# EAGLE design MODUL_CAN_V100 (EAGLE 6.4)
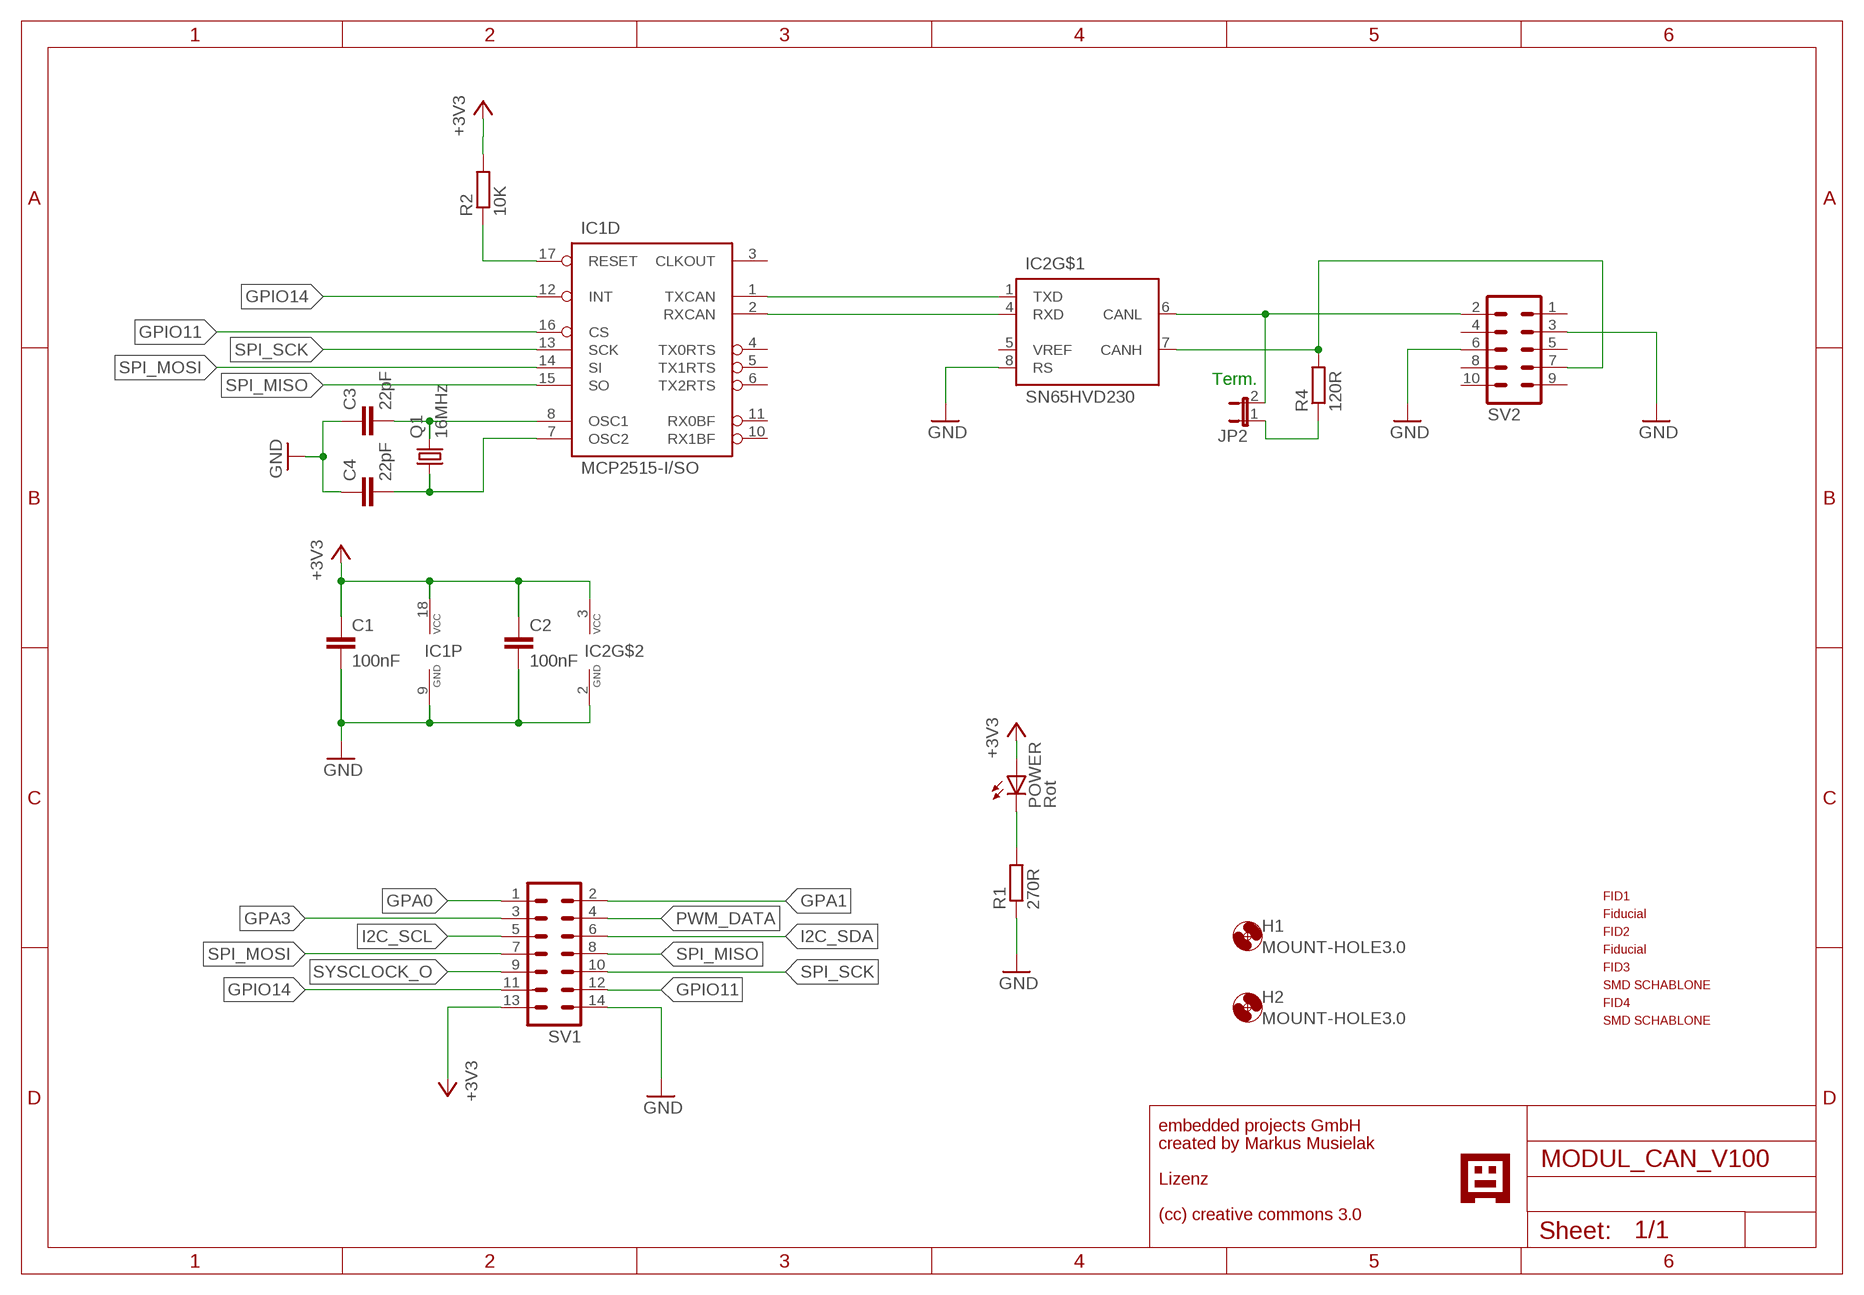
[diagram p0: schematic, sheet 1]

## Parts
C1  100nF  C-EUC0805  [C0805]
C2  100nF  C-EUC0805  [C0805]
C3  22pF  C-EUC0805  [C0805]
C4  22pF  C-EUC0805  [C0805]
FID1  PASSERMARKEN_FIDUCIAL  [PASSERMARKEN_FIDUCIAL]
FID2  PASSERMARKEN_FIDUCIAL  [PASSERMARKEN_FIDUCIAL]
FID3  PASSERMARKEN_FIDUCIAL  [PASSERMARKEN_FIDUCIAL]
FID4  PASSERMARKEN_FIDUCIAL  [PASSERMARKEN_FIDUCIAL]
H1  MOUNT-HOLE3.0  [3,0]
H2  MOUNT-HOLE3.0  [3,0]
IC1  MCP2515-I/SO  MCP2515SO  [SO-18W]
IC2  SN65HVD230  MCP2551SO8  [SO08]
JP2  JP1E  [JP1]
POWER  Rot  LEDCHIP-LED0805  [CHIP-LED0805]
Q1  16MHz  CRYSTALHC49UP  [HC49UP]
R1  270R  R-EU_R0805  [R0805]
R2  10K  R-EU_R0805  [R0805]
R4  120R  R-EU_R0805  [R0805]
SV1  ML14  [ML14]
SV2  ML10  [ML10]
U$2  GNUBLINLOGOSIEB  [GNUSIEBDRUCK]

## Nets
+3V3: C1.1 C2.1 IC1.18(P:VCC) IC2.3(VCC) POWER.A R2.2 SV1.13
CANH: IC2.7(CANH) R4.2 SV2.7
CANL: IC2.6(CANL) JP2.2 SV2.2
GND: C1.2 C2.2 C3.1 C4.1 IC1.9(P:GND) IC2.2(GND) IC2.8(RS) R1.1 SV1.14 SV2.3 SV2.6
GPA0: SV1.1
GPA1: SV1.2
GPA3: SV1.3
GPIO11: IC1.16(D:CS) SV1.12
GPIO14: IC1.12(D:INT) SV1.11
I2C_SCL: SV1.5
I2C_SDA: SV1.6
N$2: C3.2 IC1.8(D:OSC1) Q1.2
N$3: C4.2 IC1.7(D:OSC2) Q1.1
N$4: IC1.1(D:TXCAN) IC2.1(TXD)
N$5: IC1.2(D:RXCAN) IC2.4(RXD)
N$6: IC1.17(D:RESET) R2.1
N$9: POWER.C R1.2
N$11: JP2.1 R4.1
PWM_DATA: SV1.4
SPI_MISO: IC1.15(D:SO) SV1.8
SPI_MOSI: IC1.14(D:SI) SV1.7
SPI_SCK: IC1.13(D:SCK) SV1.10
SYSCLOCK_O: SV1.9
Unconnected: IC1.3(D:CLKOUT) IC1.4(D:TX0RTS) IC1.5(D:TX1RTS) IC1.6(D:TX2RTS) IC1.10(D:RX1BF) IC1.11(D:RX0BF) IC2.5(VREF) SV2.1 SV2.4 SV2.5 SV2.8 SV2.9 SV2.10

## Notes on the sheet
- Term.
- embedded projects GmbH
- created by Markus Musielak
- Lizenz
- (cc) creative commons 3.0

## Library data of the parts
C1-C4 = rcl:C-EU: CAPACITOR, European symbol
FID1 FID2 = KUBUS3:PASSERMARKEN_FIDUCIAL: SMD Passermarke
FID3 FID4 = SMDSCHABLONE:PASSERMARKEN_FIDUCIAL: SMD Passermarke
H1 H2 = holes:MOUNT-HOLE: MOUNTING HOLE with drill center marker
IC1 = can:MCP2515: MC2515 Stand-Alone CAN Controller With SPI Interface, Microchip; FARNELL: 1292239
IC2 = can:MCP2551: CAN Tranceiver Microchip; FARNELL: 1103105
JP2 = jumper:JP1E: JUMPER
POWER = led:LED: LED OSRAM: - CHIPLED LG R971, LG N971, LY N971, LG Q971, LY Q971, LO R971, LY R971 LH N974, LH R974 LS Q976, LO Q976, LY Q976 LO Q996 - Hyper CHIPLED LW Q18S LB Q993, LB Q99A, LB R99A - SideLED LS A670, LO A670, LY A670, LG A670, LP A670 LB A673, LV A673, LT A673, LW A673 LH A674 LY A675 LS A676, LA A676, LO A676, LY A676, LW A676 LS A679, LY A679, LG A679 - Hyper Micro SIDELED® LS Y876, LA Y876, LO Y876, LY Y876 LT Y87S - SmartLED LW L88C, LW L88S LB L89C, LB L89S, LG L890 LS L89K, LO L89K, LY L89K LS L896, LA L896, LO L896, LY L896 - TOPLED LS T670, LO T670, LY T670, LG T670, LP T670 LSG T670, LSP T670, LSY T670, LOP T670, LYG T670 LG T671, LOG T671, LSG T671 LB T673, LV T673, LT T673, LW T673 LH T674 LS T676, LA T676, LO T676, LY T676, LB T676, LH T676, LSB T676, LW T676 LB T67C, LV T67C, LT T67C, LS T67K, LO T67K, LY T67K, LW E67C LS E67B, LA E67B, LO E67B, LY E67B, LB E67C, LV E67C, LT E67C LW T67C LS T679, LY T679, LG T679 LS T770, LO T770, LY T770, LG T770, LP T770 LB T773, LV T773, LT T773, LW T773 LH T774 LS E675, LA E675, LY E675, LS T675 LS T776, LA T776, LO T776, LY T776, LB T776 LHGB T686 LT T68C, LB T68C - Hyper Mini TOPLED® LB M676 - Mini TOPLED Santana® LG M470 LS M47K, LO M47K, LY M47K Source: http://www.osram.convergy.de LUXEON: - LUMILED® LXK2-PW12-R00, LXK2-PW12-S00, LXK2-PW14-U00, LXK2-PW14-V00 LXK2-PM12-R00, LXK2-PM12-S00, LXK2-PM14-U00 LXK2-PE12-Q00, LXK2-PE12-R00, LXK2-PE12-S00, LXK2-PE14-T00, LXK2-PE14-U00 LXK2-PB12-K00, LXK2-PB12-L00, LXK2-PB12-M00, LXK2-PB14-N00, LXK2-PB14-P00, LXK2-PB14-Q00 LXK2-PR12-L00, LXK2-PR12-M00, LXK2-PR14-Q00, LXK2-PR14-R00 LXK2-PD12-Q00, LXK2-PD12-R00, LXK2-PD12-S00 LXK2-PH12-R00, LXK2-PH12-S00 LXK2-PL12-P00, LXK2-PL12-Q00, LXK2-PL12-R00 Source: www.luxeon.com KINGBRIGHT: KA-3528ASYC Source: www.kingbright.com
Q1 = crystal:CRYSTAL: CRYSTAL; OC_FARNELL: unknown; OC_NEWARK: unknown
R1 R2 R4 = rcl:R-EU_: RESISTOR, European symbol
SV1 = con-ml:ML14: HARTING; OC_FARNELL: unknown; OC_NEWARK: unknown
SV2 = con-ml:ML10: HARTING
U$2 = EmbeddedProjectsLogos2:GNUBLINLOGO

## Board
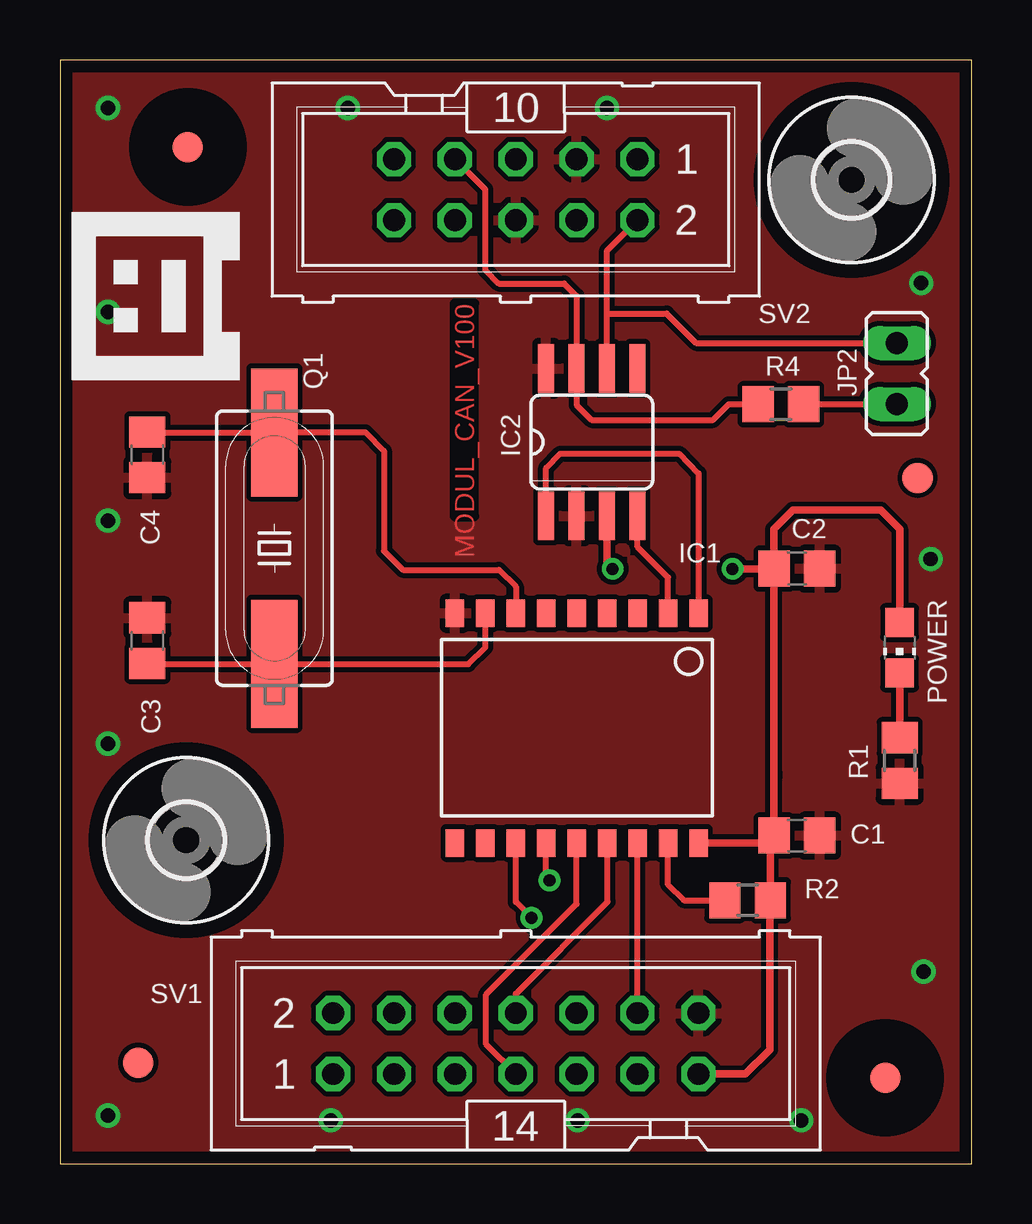
[diagram p1: board, top side]
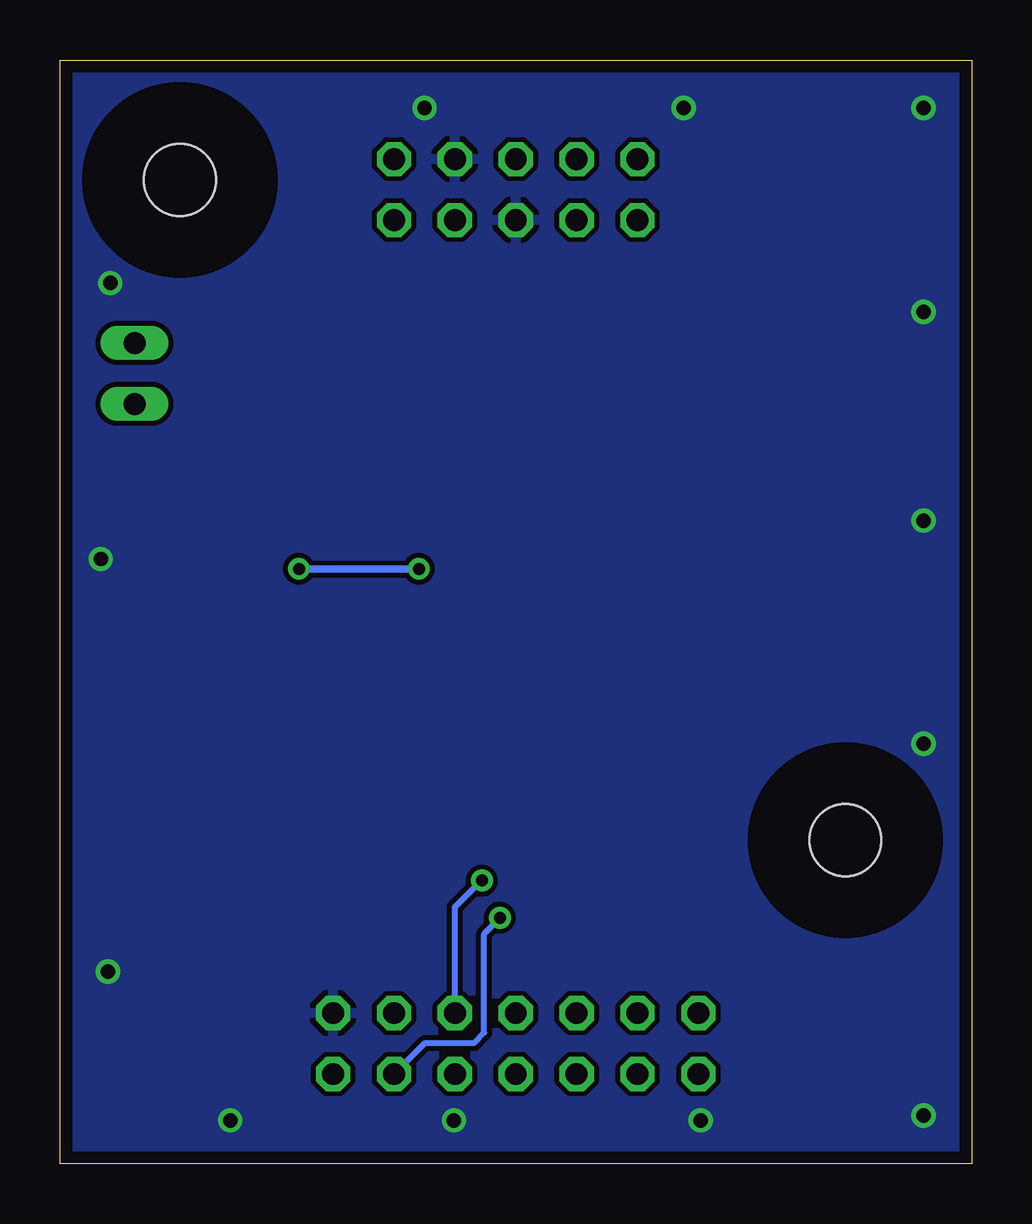
[diagram p2: board, bottom side, seen from below]

Size 38 x 46 mm. Coordinates in mm from the lower left corner, seen from the top.
Outline: 0,0 38,0 38,46 0,46 0,0
Copper layers (1*16): Top 0.035mm / dielectric 1.5mm / Bottom 0.035mm
Design rules "default *": minimum track width 10mil, minimum drill 24mil, track to track 8mil, track to pad 8mil, pad to pad 8mil, via to via 8mil, smd to smd 8mil, copper to edge 20mil, drill to drill 8mil, minimum pad ring 10mil, minimum via ring 8mil, stop-mask expansion 2mil, vias tented up to drill 40mil, thermal gap 10mil

### Footprints (pad centres in the part's own frame; a part is rotated, then mirrored left to right if it is on the bottom)
C0805 = smd 1.3 x 1.5: 1 -0.95,0; 2 0.95,0
PASSERMARKEN_FIDUCIAL = smd 1.27 x 1.27: 1 0,0
3,0 = hole 3: 0,0
SO-18W = smd 0.762 x 1.143: 1 -5.08,-4.788; 2 -3.81,-4.788; 3 -2.54,-4.788; 4 -1.27,-4.788; 5 0,-4.788; 6 1.27,-4.788; 7 2.54,-4.788; 8 3.81,-4.788; 9 5.08,-4.788; 10 5.08,4.788; 11 3.81,4.788; 12 2.54,4.788; 13 1.27,4.788; 14 0,4.788; 15 -1.27,4.788; 16 -2.54,4.788; 17 -3.81,4.788; 18 -5.08,4.788
SO08 = smd 0.66 x 2.032: 1 -1.905,-3.073; 2 -0.635,-3.073; 3 0.635,-3.073; 4 1.905,-3.073; 5 1.905,3.073; 6 0.635,3.073; 7 -0.635,3.073; 8 -1.905,3.073
JP1 = drill 0.914 long: 1 0,-1.27; 2 0,1.27
CHIP-LED0805 = smd 1.2 x 1.2: A 0,-1.05; C 0,1.05
HC49UP = smd 5.334 x 1.93: 1 -4.826,0; 2 4.826,0
R0805 = smd 1.3 x 1.5: 1 -0.95,0; 2 0.95,0
ML14 = drill 0.914 octagon: 1 -7.62,-1.27; 2 -7.62,1.27; 3 -5.08,-1.27; 4 -5.08,1.27; 5 -2.54,-1.27; 6 -2.54,1.27; 7 0,-1.27; 8 0,1.27; 9 2.54,-1.27; 10 2.54,1.27; 11 5.08,-1.27; 12 5.08,1.27; 13 7.62,-1.27; 14 7.62,1.27
ML10 = drill 0.914 octagon: 1 -5.08,-1.27; 2 -5.08,1.27; 3 -2.54,-1.27; 4 -2.54,1.27; 5 0,-1.27; 6 0,1.27; 7 2.54,-1.27; 8 2.54,1.27; 9 5.08,-1.27; 10 5.08,1.27

### Placement (x,y rotation side)
C1  30.72,13.67 0 top
C2  30.72,24.8 0 top
C3  3.64,21.8 270 top
C4  3.64,29.54 90 top
FID1  34.4,3.57 0 top
FID2  5.33,42.37 0 top
FID3  3.26,4.2 0 top
FID4  35.75,28.58 0 top
H1  5.26,13.48 0 top
H2  33,41 0 top
IC1  21.54,18.15 180 top
IC2  22.17,30.07 0 top
JP2  34.89,32.93 0 top
POWER  35,21.5 180 top
Q1  8.94,25.65 270 top
R1  35,16.8 90 top
R2  28.67,10.97 0 top
R4  30.05,31.65 180 top
SV1  19,5 0 top
SV2  19,40.6 180 top
U$2  7.49,32.65 90 top

### Tracks (layer width: path | path; a pad name or v marks a point on that pad's centre or on a via)
+3V3  (via drill 0.5)
  Top 0.305: SV1.13 28.57,3.73 29.59,4.75 29.59,10.94 R2.2 29.62,13.52 C1.1 | IC1.18 27.92,13.36 29.46,13.36 C1.1 | C1.1 29.77,16.13 | 29.77,16.13 29.77,16.27 | 29.77,16.27 C2.1 | POWER.A 35,26.45 34.22,27.23 30.55,27.23 29.76,26.44 C2.1 | IC2.3 22.8,25.02 v23.04,24.79 | v28.04,24.79 C2.1 | 29.77,16.13 29.77,16.27
  Bottom 0.305: v28.04,24.79 v23.04,24.79
CANH
  Top 0.254: R4.2 27.88,31.65 27.22,30.99 22.16,30.99 21.54,31.61 IC2.7 21.54,36.16 21.02,36.68 18.29,36.68 17.73,37.24 17.73,40.6 SV2.7
CANL
  Top 0.254: IC2.6 22.8,35.35 | JP2.2 26.52,34.2 25.29,35.43 22.89,35.43 22.8,35.35 | 22.8,35.35 22.8,38.05 SV2.2
GND  (via drill 0.6)
  other vias: 2,2 2,17.5 2,26.8 2,44 2,35.5 12,44 22.8,44 11.29,1.8 21.58,1.8 30.9,1.8 36,8 36.3,25.2 35.9,36.7
  pour Top: -1.84,47.8 40.64,47.8 40.64,-1.52 -1.84,-1.52 -1.84,47.79
  pour Bottom: -1.56,47.83 38.98,47.83 38.98,-1.08 -1.56,-1.08
GPIO11
  Top 0.254: SV1.12 IC1.16
GPIO14  (via drill 0.5)
  Top 0.254: IC1.12 19,10.9 v19.66,10.24
  Bottom 0.254: v19.66,10.24 19.72,10.17 20.32,9.57 20.32,5.46 20.75,5.03 22.78,5.03 SV1.11
N$2
  Top 0.254: IC1.8 17.73,21.52 17.03,20.82 Q1.2 3.67,20.82 C3.2
N$3
  Top 0.254: C4.2 3.65,30.48 Q1.1 12.73,30.48 13.51,29.7 13.51,25.54 14.3,24.75 18.3,24.75 19,24.05 IC1.7
N$4
  Top 0.254: IC1.1 26.62,28.77 25.82,29.59 20.85,29.59 20.27,29 IC2.1
N$5
  Top 0.254: IC2.4 24.07,25.7 25.35,24.43 IC1.2
N$6
  Top 0.254: R2.1 26,10.97 25.35,11.62 IC1.17
N$9
  Top 0.305: R1.2 POWER.C
N$11
  Top 0.254: R4.1 JP2.1
SPI_MISO
  Top 0.254: SV1.8 19,7.08 22.83,10.91 22.83,13.34 IC1.15
SPI_MOSI
  Top 0.254: IC1.14 21.54,10.82 17.77,7.05 17.77,4.97 SV1.7
SPI_SCK  (via drill 0.5)
  Top 0.254: IC1.13 20.27,11.93 v20.41,11.8
  Bottom 0.254: v20.41,11.8 20.59,11.64 21.54,10.69 SV1.10

### Text on the board
Top: MODUL_CAN_V100
tDocu: CANH | CANL | Term. | www.gnublin.org